# EAGLE schematic VerdiRT7_MainPCB (EAGLE 8.5.2)

## Sheet 1 of 6
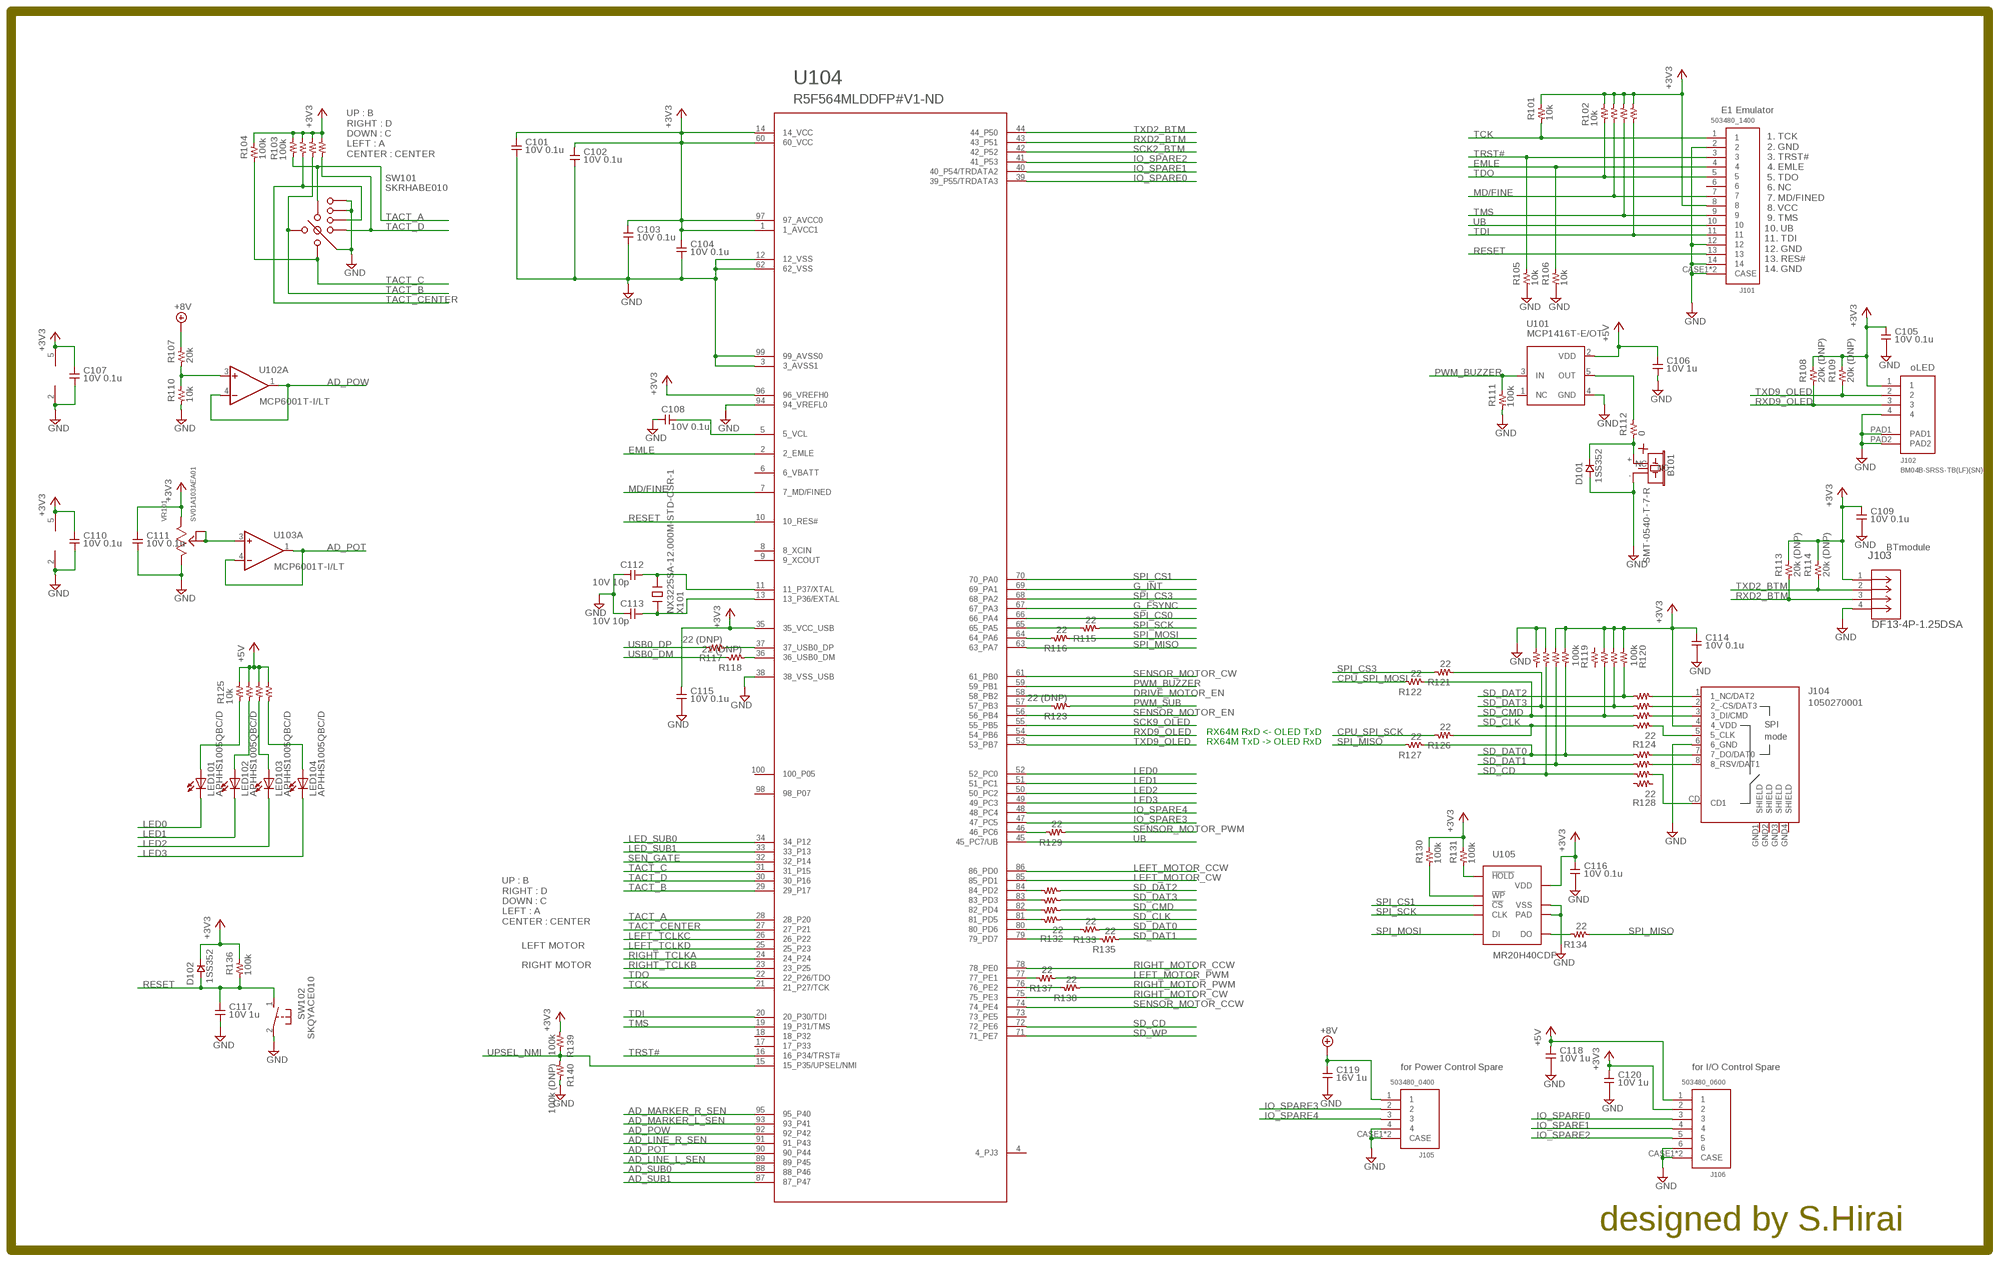
[diagram p0: schematic, sheet 1]

### Parts
B101  SMT-0540-T-7-R  [SMT-0540-S-R]
C101  10V 0.1u  1005  [1005]
C102  10V 0.1u  1005  [1005]
C103  10V 0.1u  1005  [1005]
C104  10V 0.1u  1005  [1005]
C105  10V 0.1u  1005  [1005]
C106  10V 1u  1005  [1005]
C107  10V 0.1u  1005  [1005]
C108  10V 0.1u  1005  [1005]
C109  10V 0.1u  1005  [1005]
C110  10V 0.1u  1005  [1005]
C111  10V 0.1u  1005  [1005]
C112  10V 10p  1005  [1005]
C113  10V 10p  1005  [1005]
C114  10V 0.1u  1005  [1005]
C115  10V 0.1u  1005  [1005]
C116  10V 0.1u  1005  [1005]
C117  10V 1u  1005  [1005]
C118  10V 1u  1005  [1005]
C119  16V 1u  1005  [1005]
C120  10V 1u  1005  [1005]
D101  1SS352  [2012]
D102  1SS352  [2012]
J101  503480_1400  [1400]
J102  BM04B-SRSS-TB(LF)(SN)  [BM04B-SRSS-TB]
J103  DF13-4P-1.25DSA  [DF13_4P_TH]
J104  1050270001  [MOLEX_105027]
J105  503480_0400  [0400]
J106  503480_0600  [0600]
LED101  APHHS1005QBC/D  LED1005  [1005]
LED102  APHHS1005QBC/D  LED1005  [1005]
LED103  APHHS1005QBC/D  LED1005  [1005]
LED104  APHHS1005QBC/D  LED1005  [1005]
R101  10k  R1005  [1005]
R102  10k  3216_ARRAY  [3216_ARRAY]
R103  100k  3216_ARRAY  [3216_ARRAY]
R104  100k  R1005  [1005]
R105  10k  R1005  [1005]
R106  10k  R1005  [1005]
R107  20k  R1005  [1005]
R108  20k (DNP)  R1005  [1005]
R109  20k (DNP)  R1005  [1005]
R110  10k  R1005  [1005]
R111  100k  R1005  [1005]
R112  0  R1005  [1005]
R113  20k (DNP)  R1005  [1005]
R114  20k (DNP)  R1005  [1005]
R115  22  R1005  [1005]
R116  22  R1005  [1005]
R117  22 (DNP)  R1005  [1005]
R118  22 (DNP)  R1005  [1005]
R119  100k  3216_ARRAY  [3216_ARRAY]
R120  100k  3216_ARRAY  [3216_ARRAY]
R121  22  R1005  [1005]
R122  22  R1005  [1005]
R123  22 (DNP)  R1005  [1005]
R124  22  3216_ARRAY  [3216_ARRAY]
R125  10k  3216_ARRAY  [3216_ARRAY]
R126  22  R1005  [1005]
R127  22  R1005  [1005]
R128  22  3216_ARRAY  [3216_ARRAY]
R129  22  R1005  [1005]
R130  100k  R1005  [1005]
R131  100k  R1005  [1005]
R132  22  3216_ARRAY  [3216_ARRAY]
R133  22  R1005  [1005]
R134  22  R1005  [1005]
R135  22  R1005  [1005]
R136  100k  R1005  [1005]
R137  22  R1005  [1005]
R138  22  R1005  [1005]
R139  100k  R1005  [1005]
R140  100k (DNP)  R1005  [1005]
SW101  SKRHABE010  [SKRH]
SW102  SKQYACE010  [SKQYA]
U101  MCP1416T-E/OT  [SOT23-5]
U102  MCP6001T-I/LT  [SOT-70-5]
U103  MCP6001T-I/LT  [SOT-70-5]
U104  R5F564MLDDFP#V1-ND  [TQFP100-16X16]
U105  MR20H40CDF  [8DFN]
VR101  SV01A103AEA01  [SV01]
X101  NX3225SA-12.000M-STD-CSR-1  [3225]

### Nets
+3V3: C101.P$1 C102.P$1 C103.P$1 C104.P$1 C105.P$1 C107.P$1 C109.P$1 C110.P$1 C111.P$1 C114.P$1 C115.P$1 C116.P$1 C120.P$1 D102.K J101.8 J102.1 J103.1 J104.4(4_VDD) J106.2 R101.P$2 R102.R1-B R102.R2-B R102.R3-B R102.R4-B R103.R1-B R103.R2-B R103.R3-B R103.R4-B R104.P$2 R108.P$2 R109.P$2 R113.P$2 R114.P$2 R119.R1-A R119.R2-A R120.R1-A R120.R2-A R120.R3-A R130.P$2 R131.P$2 R136.P$2 R139.P$1 U102.5(V+) U103.5(V+) U104.1(1_AVCC1) U104.14(14_VCC) U104.35(35_VCC_USB) U104.60(60_VCC) U104.96(96_VREFH0) U104.97(97_AVCC0) U105.8(VDD) VR101.2 ; also sheet 2,3,4,5
+5V: C106.P$1 C118.P$1 J106.1 R125.R1-B R125.R2-B R125.R3-B R125.R4-B U101.2(VDD) ; also sheet 2,3,4
+8V: C119.P$1 J105.1 R107.P$2 ; also sheet 2,3
AD_LINE_L_SEN: U104.89(89_P45) ; also sheet 4
AD_LINE_R_SEN: U104.91(91_P43) ; also sheet 4
AD_MARKER_L_SEN: U104.93(93_P41) ; also sheet 4
AD_MARKER_R_SEN: U104.95(95_P40) ; also sheet 4
AD_POT: U103.1(A:OUT) U103.4(A:-IN) U104.90(90_P44)
AD_POW: U102.1(A:OUT) U102.4(A:-IN) U104.92(92_P42)
AD_SUB0: U104.88(88_P46)
AD_SUB1: U104.87(87_P47)
CPU_SD_DAT0: R133.P$2 U104.80(80_PD6)
CPU_SPI_MOSI: R116.P$2 R122.P$2 U104.64(64_PA6)
CPU_SPI_SCK: R115.P$2 R126.P$2 U104.65(65_PA5)
DRIVE_MOTOR_EN: U104.58(58_PB2) ; also sheet 3
EMLE: J101.4 R106.P$2 U104.2(2_EMLE)
G_FSYNC: U104.67(67_PA3) ; also sheet 5
G_INT: U104.69(69_PA1) ; also sheet 5
GND: B101.- C101.P$2 C102.P$2 C103.P$2 C104.P$2 C105.P$2 C106.P$2 C107.P$2 C108.P$2 C109.P$2 C110.P$2 C111.P$2 C112.P$2 C113.P$2 C114.P$2 C115.P$2 C116.P$2 C117.P$2 C118.P$2 C119.P$2 C120.P$2 D101.A J101.2 J101.12 J101.14 J101.CASE1(CASE) J101.CASE2(CASE) J102.4 J102.PAD1 J102.PAD2 J103.4 J104.6(6_GND) J105.4 J105.CASE1(CASE) J105.CASE2(CASE) J106.6 J106.CASE1(CASE) J106.CASE2(CASE) R105.P$1 R106.P$1 R110.P$1 R111.P$1 R119.R3-A R119.R4-A R140.P$2 SW101.1 SW101.2 SW101.COMMON SW102.2 U101.4(GND) U102.2(V-) U103.2(V-) U104.3(3_AVSS1) U104.12(12_VSS) U104.38(38_VSS_USB) U104.62(62_VSS) U104.94(94_VREFL0) U104.99(99_AVSS0) U105.4(VSS) U105.PAD VR101.1 ; also sheet 2,3,4,5
IO_SPARE0: J106.3 U104.39(39_P55/TRDATA3)
IO_SPARE1: J106.4 U104.40(40_P54/TRDATA2)
IO_SPARE2: J106.5 U104.41(41_P53)
IO_SPARE3: J105.2 U104.47(47_PC5)
IO_SPARE4: J105.3 U104.48(48_PC4)
LED0: LED101.K U104.52(52_PC0)
LED1: LED102.K U104.51(51_PC1)
LED2: LED103.K U104.50(50_PC2)
LED3: LED104.K U104.49(49_PC3)
LED_SUB0: U104.34(34_P12)
LED_SUB1: U104.33(33_P13)
LEFT_MOTOR_CCW: U104.86(86_PD0) ; also sheet 3
LEFT_MOTOR_CW: U104.85(85_PD1) ; also sheet 3
LEFT_MOTOR_PWM: R137.P$1 ; also sheet 3
LEFT_TCLKC: U104.26(26_P22) ; also sheet 3
LEFT_TCLKD: U104.25(25_P23) ; also sheet 3
MD/FINE: J101.7 R102.R2-A U104.7(7_MD/FINED)
N$6: C108.P$1 U104.5(5_VCL)
N$13: C112.P$1 U104.11(11_P37/XTAL) X101.3
N$16: R131.P$1 U105.7(!HOLD)
N$17: R112.P$2 U101.5(OUT)
N$18: B101.+ D101.K R112.P$1
N$20: U103.3(A:+IN) VR101.3 VR101.4
N$21: R130.P$1 U105.3(!WP)
N$23: C113.P$1 U104.13(13_P36/EXTAL) X101.1
N$24: J104.5(5_CLK) R124.R1-A
N$25: J104.3(3_DI/CMD) R124.R2-A
N$26: J104.2(2_-CS/DAT3) R124.R3-A
N$27: R107.P$1 R110.P$2 U102.3(A:+IN)
N$28: J104.1(1_NC/DAT2) R124.R4-A
N$32: J104.8(8_RSV/DAT1) R128.R3-A
N$45: R134.P$2 U105.2(DO)
N$53: J104.7(7_DO/DAT0) R128.R4-A
N$56: LED101.A R125.R1-A
N$57: LED102.A R125.R2-A
N$58: LED103.A R125.R3-A
N$59: LED104.A R125.R4-A
N$83: J104.CD(CD1) R128.R2-A
N$89: R132.R4-B U104.84(84_PD2)
N$90: R132.R3-B U104.83(83_PD3)
N$91: R132.R2-B U104.82(82_PD4)
N$92: R132.R1-B U104.81(81_PD5)
N$93: R135.P$2 U104.79(79_PD7)
N$94: R123.P$2 U104.57(57_PB3)
N$95: R117.P$1 U104.37(37_USB0_DP)
N$96: R118.P$1 U104.36(36_USB0_DM)
PWM_BUZZER: R111.P$2 U101.3(IN) U104.59(59_PB1)
PWM_MOT1_MPU: R137.P$2 U104.77(77_PE1)
PWM_MOT2_MPU: R138.P$2 U104.76(76_PE2)
PWM_MOT3_MPU: R129.P$2 U104.46(46_PC6)
PWM_SUB: R123.P$1
RESET: C117.P$1 D102.A J101.13 R136.P$1 SW102.1 U104.10(10_RES#)
RIGHT_MOTOR_CCW: U104.78(78_PE0) ; also sheet 3
RIGHT_MOTOR_CW: U104.75(75_PE3) ; also sheet 3
RIGHT_MOTOR_PWM: R138.P$1 ; also sheet 3
RIGHT_TCLKA: U104.24(24_P24) ; also sheet 3
RIGHT_TCLKB: U104.23(23_P25) ; also sheet 3
RXD2_BTM: J103.3 R113.P$1 U104.43(43_P51)
RXD9_OLED: J102.3 R108.P$1 U104.54(54_PB6)
SCK2_BTM: U104.42(42_P52)
SCK9_OLED: U104.55(55_PB5)
SD_CD: R119.R3-B R128.R2-B U104.72(72_PE6)
SD_CLK: R124.R1-B R126.P$1 R132.R1-A
SD_CMD: R120.R3-B R122.P$1 R124.R2-B R132.R2-A
SD_DAT0: R119.R1-B R127.P$1 R128.R4-B R133.P$1
SD_DAT1: R119.R2-B R128.R3-B R135.P$1
SD_DAT2: R120.R1-B R124.R4-B R132.R4-A
SD_DAT3: R120.R2-B R121.P$1 R124.R3-B R132.R3-A
SD_WP: U104.71(71_PE7)
SEN_GATE: U104.32(32_P14) ; also sheet 4
SENSOR_MOTOR_CCW: U104.74(74_PE4) ; also sheet 3
SENSOR_MOTOR_CW: U104.61(61_PB0) ; also sheet 3
SENSOR_MOTOR_EN: U104.56(56_PB4) ; also sheet 3
SENSOR_MOTOR_PWM: R129.P$1 ; also sheet 3
SPI_CS0: U104.66(66_PA4) ; also sheet 5
SPI_CS1: U104.70(70_PA0) U105.1(!CS)
SPI_CS3: R121.P$2 U104.68(68_PA2)
SPI_MISO: R127.P$2 R134.P$1 U104.63(63_PA7) ; also sheet 5
SPI_MOSI: R116.P$1 U105.5(DI) ; also sheet 5
SPI_SCK: R115.P$1 U105.6(CLK) ; also sheet 5
TACT_A: R103.R1-A SW101.A U104.28(28_P20)
TACT_B: R103.R3-A SW101.B U104.29(29_P17)
TACT_C: R104.P$1 SW101.C U104.31(31_P15)
TACT_CENTER: R103.R2-A SW101.CENTER U104.27(27_P21)
TACT_D: R103.R4-A SW101.D U104.30(30_P16)
TCK: J101.1 R101.P$1 U104.21(21_P27/TCK)
TDI: J101.11 R102.R4-A U104.20(20_P30/TDI)
TDO: J101.5 R102.R1-A U104.22(22_P26/TDO)
TMS: J101.9 R102.R3-A U104.19(19_P31/TMS)
TRST#: J101.3 R105.P$2 U104.16(16_P34/TRST#)
TXD2_BTM: J103.2 R114.P$1 U104.44(44_P50)
TXD9_OLED: J102.2 R109.P$1 U104.53(53_PB7)
UB: J101.10 U104.45(45_PC7/UB)
UPSEL_NMI: R139.P$2 R140.P$1 U104.15(15_P35/UPSEL/NMI)
USB0_DM: R118.P$2
USB0_DP: R117.P$2
Unconnected: B101.NC J101.6 J104.GND1(SHIELD) J104.GND2(SHIELD) J104.GND3(SHIELD) J104.GND4(SHIELD) R119.R4-B R120.R4-A R120.R4-B R128.R1-A R128.R1-B U101.1(NC) U104.4(4_PJ3) U104.6(6_VBATT) U104.8(8_XCIN) U104.9(9_XCOUT) U104.17(17_P33) U104.18(18_P32) U104.73(73_PE5) U104.98(98_P07) U104.100(100_P05) X101.2 X101.4

### Notes on the sheet
- E1 Emulator
- 1. TCK
   2. GND
   3. TRST#
   4. EMLE
   5. TDO
   6. NC
   7. MD/FINED
   8. VCC
   9. TMS
  10. UB
  11. TDI
  12. GND
  13. RES#
  14. GND
- UP : B
  RIGHT : D
  DOWN : C
  LEFT : A
  CENTER : CENTER
- oLED
- BTmodule
- RX64M RxD <- OLED TxD
- RX64M TxD -> OLED RxD
- UP : B
  RIGHT : D
  DOWN : C
  LEFT : A
  CENTER : CENTER
- LEFT MOTOR
- RIGHT MOTOR
- for Power Control Spare | for I/O Control Spare
- designed by S.Hirai

## Sheet 2 of 6
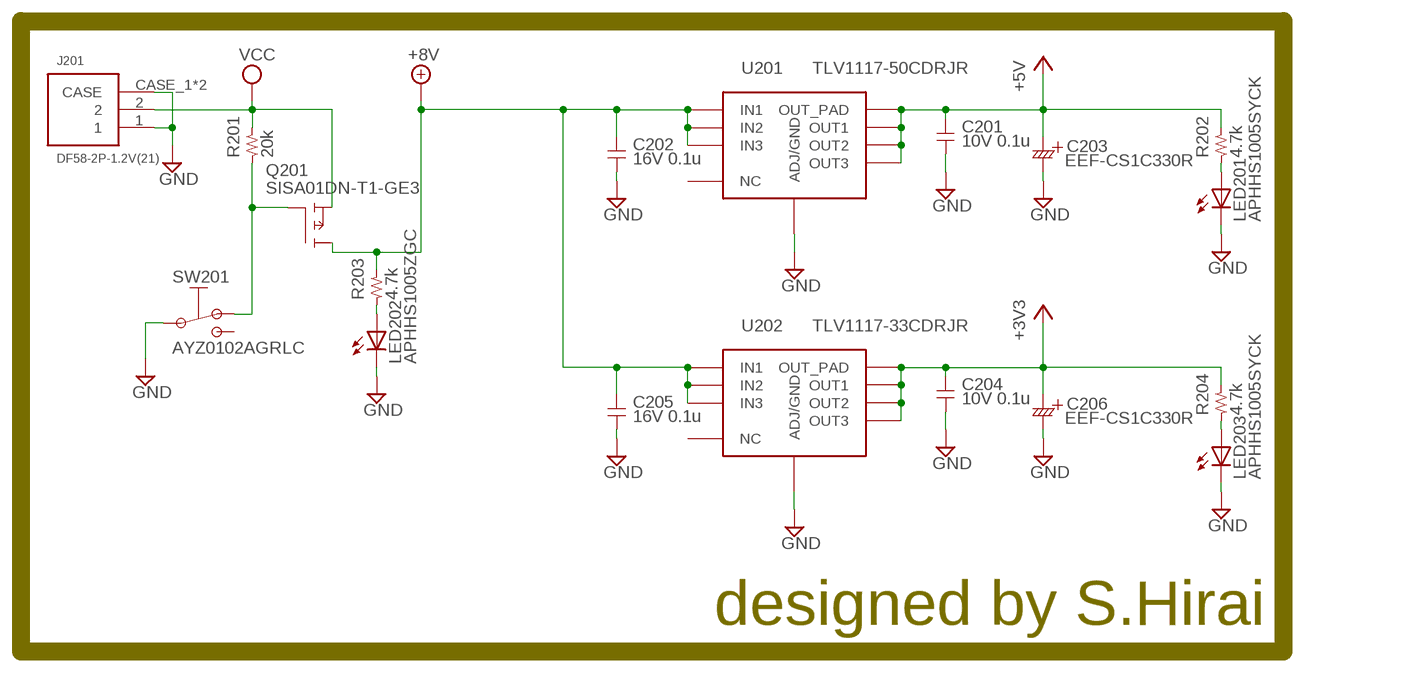
[diagram p1: schematic, sheet 2]

### Parts
C201  10V 0.1u  1005  [1005]
C202  16V 0.1u  1005  [1005]
C203  EEF-CS1C330R  [EEFC_7343]
C204  10V 0.1u  1005  [1005]
C205  16V 0.1u  1005  [1005]
C206  EEF-CS1C330R  [EEFC_7343]
J201  DF58-2P-1.2V(21)  [DF58_2P]
LED201  APHHS1005SYCK  LED1005  [1005]
LED202  APHHS1005ZGC  LED1005  [1005]
LED203  APHHS1005SYCK  LED1005  [1005]
Q201  SISA01DN-T1-GE3  [POWERPAK1212-8]
R201  20k  R1005  [1005]
R202  4.7k  R1005  [1005]
R203  4.7k  R1005  [1005]
R204  4.7k  R1005  [1005]
SW201  AYZ0102AGRLC  [AYZ0102AGRLC]
U201  TLV1117-50CDRJR  [WFDFN8]
U202  TLV1117-33CDRJR  [WFDFN8]

### Nets
+3V3: C204.P$1 C206.PLUS R204.P$2 U202.5(OUT1) U202.6(OUT2) U202.7(OUT3) U202.PAD(OUT_PAD) ; also sheet 1,3,4,5
+5V: C201.P$1 C203.PLUS R202.P$2 U201.5(OUT1) U201.6(OUT2) U201.7(OUT3) U201.PAD(OUT_PAD) ; also sheet 1,3,4
+8V: C202.P$1 C205.P$1 Q201.5(D) Q201.9(D) R203.P$2 U201.2(IN1) U201.3(IN2) U201.4(IN3) U202.2(IN1) U202.3(IN2) U202.4(IN3) ; also sheet 1,3
GND: C201.P$2 C202.P$2 C203.MINUS C204.P$2 C205.P$2 C206.MINUS J201.1 J201.CASE_1(CASE) J201.CASE_2(CASE) LED201.K LED202.K LED203.K SW201.2 U201.1(ADJ/GND) U202.1(ADJ/GND) ; also sheet 1,3,4,5
N$1: Q201.4(G) R201.P$1 SW201.1
N$3: LED202.A R203.P$1
N$12: LED201.A R202.P$1
N$78: LED203.A R204.P$1
VCC: J201.2 Q201.1(S) R201.P$2
Unconnected: SW201.3 U201.8(NC) U202.8(NC)

### Notes on the sheet
- designed by S.Hirai

## Sheet 3 of 6
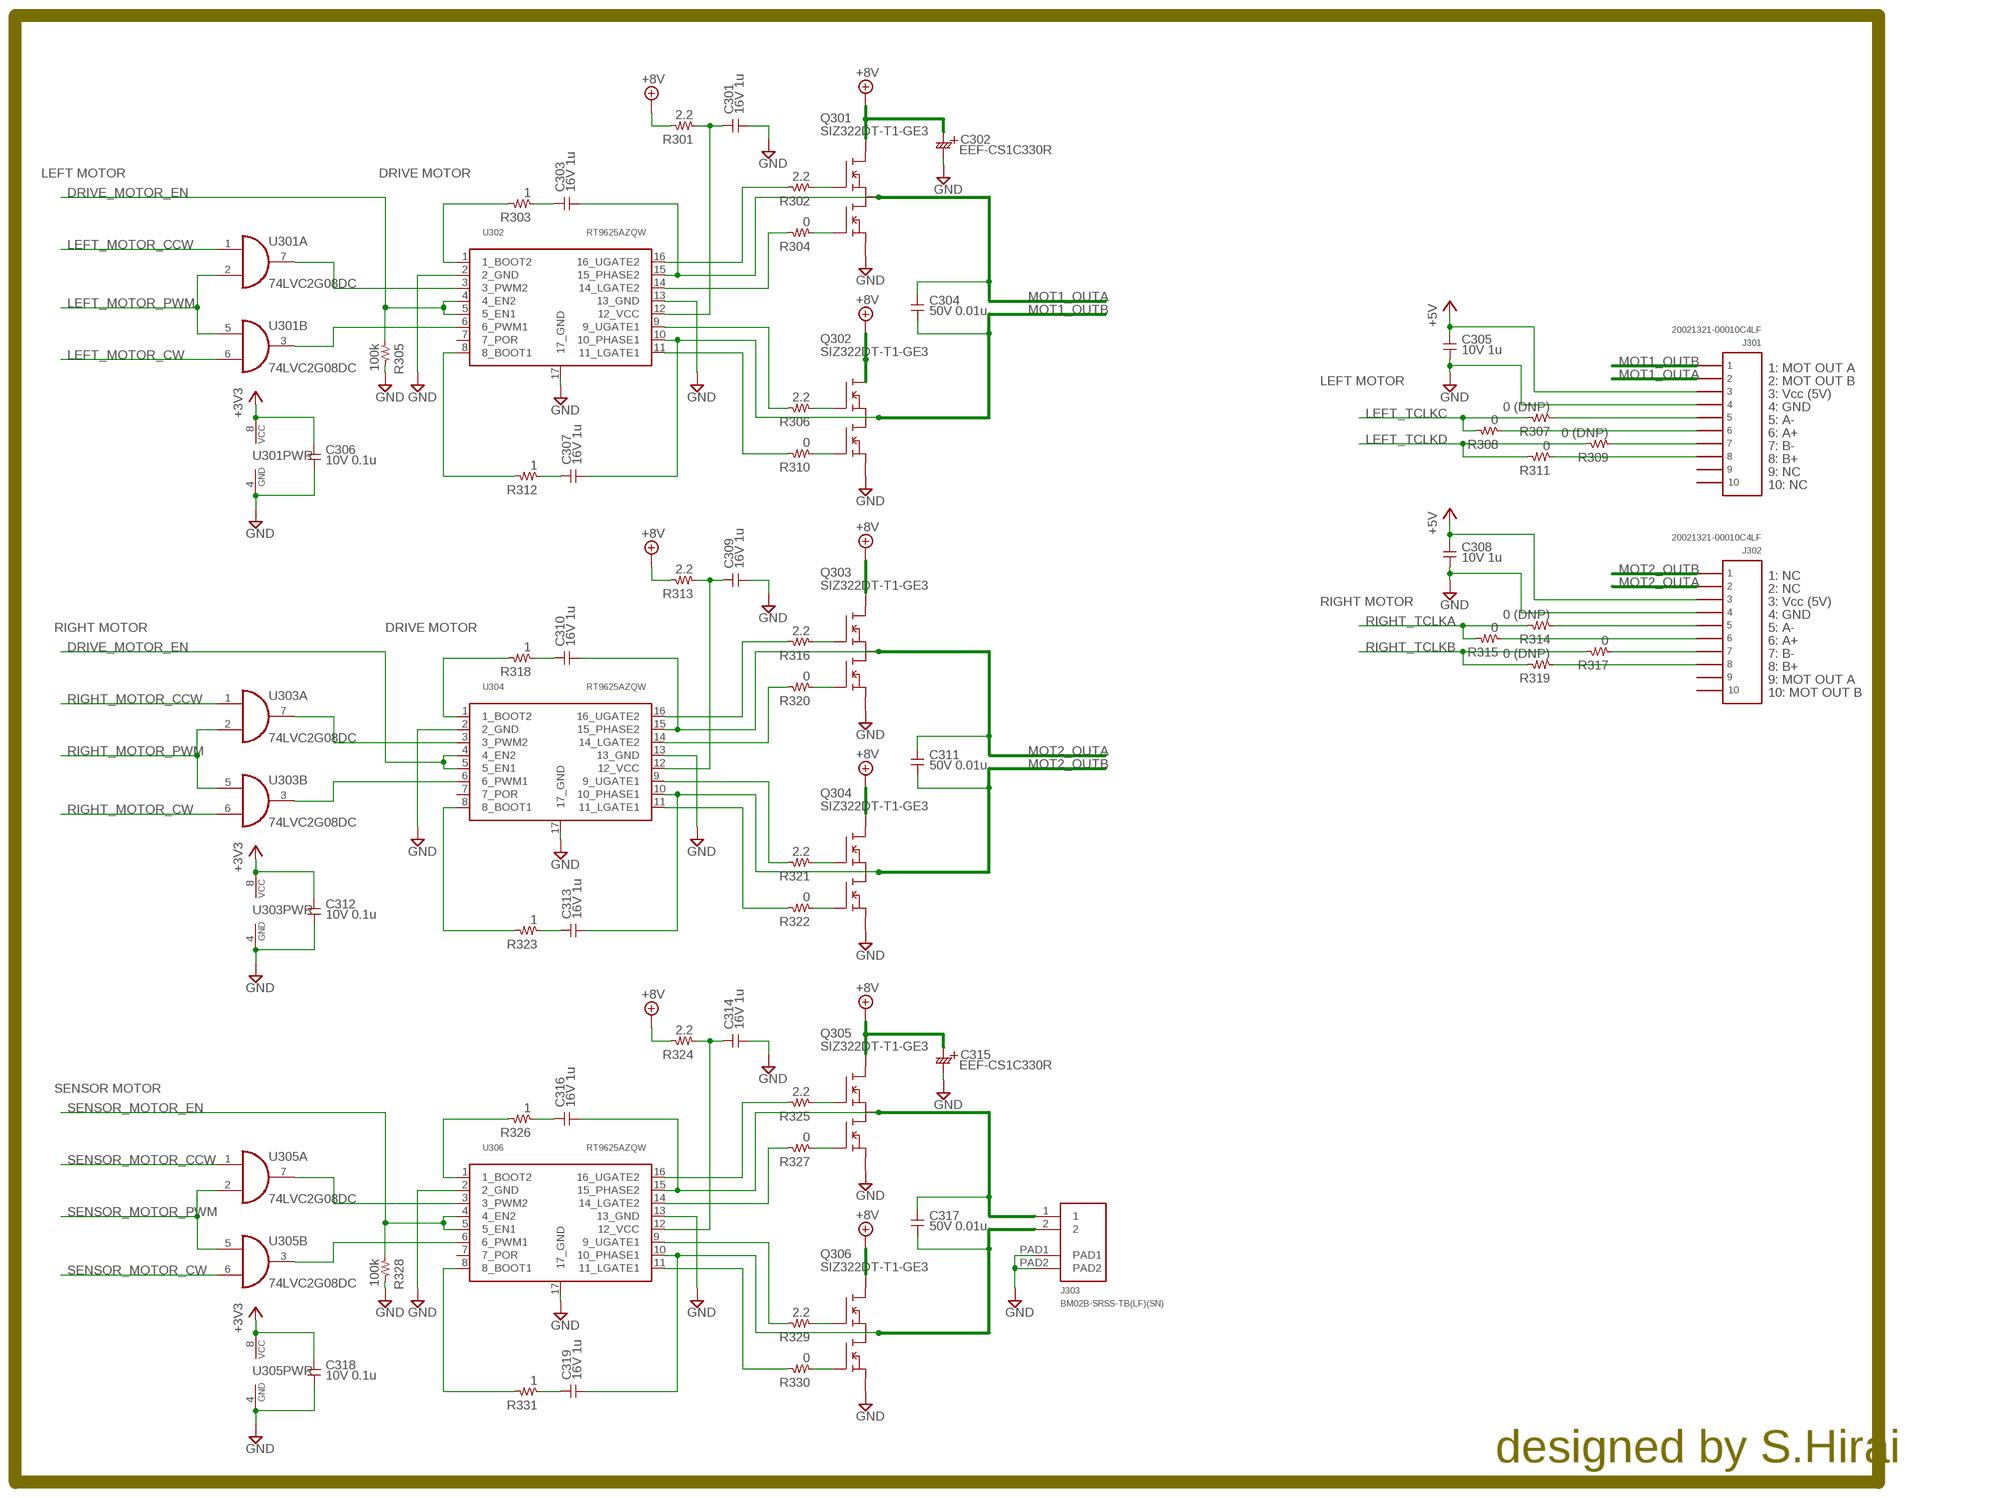
[diagram p2: schematic, sheet 3]

### Parts
C301  16V 1u  1005  [1005]
C302  EEF-CS1C330R  [EEFC_7343]
C303  16V 1u  1005  [1005]
C304  50V 0.01u  1005  [1005]
C305  10V 1u  1005  [1005]
C306  10V 0.1u  1005  [1005]
C307  16V 1u  1005  [1005]
C308  10V 1u  1005  [1005]
C309  16V 1u  1005  [1005]
C310  16V 1u  1005  [1005]
C311  50V 0.01u  1005  [1005]
C312  10V 0.1u  1005  [1005]
C313  16V 1u  1005  [1005]
C314  16V 1u  1005  [1005]
C315  EEF-CS1C330R  [EEFC_7343]
C316  16V 1u  1005  [1005]
C317  50V 0.01u  1005  [1005]
C318  10V 0.1u  1005  [1005]
C319  16V 1u  1005  [1005]
J301  20021321-00010C4LF  [MA5-2_SMD_1.27MM_MIN]
J302  20021321-00010C4LF  [MA5-2_SMD_1.27MM_MIN]
J303  BM02B-SRSS-TB(LF)(SN)  [BM02B-SRSS-TB]
Q301  SIZ322DT-T1-GE3  [DFN3X3A]
Q302  SIZ322DT-T1-GE3  [DFN3X3A]
Q303  SIZ322DT-T1-GE3  [DFN3X3A]
Q304  SIZ322DT-T1-GE3  [DFN3X3A]
Q305  SIZ322DT-T1-GE3  [DFN3X3A]
Q306  SIZ322DT-T1-GE3  [DFN3X3A]
R301  2.2  R1005  [1005]
R302  2.2  R1005  [1005]
R303  1  R1005  [1005]
R304  0  R1005  [1005]
R305  100k  R1005  [1005]
R306  2.2  R1005  [1005]
R307  0 (DNP)  R1005  [1005]
R308  0  R1005  [1005]
R309  0 (DNP)  R1005  [1005]
R310  0  R1005  [1005]
R311  0  R1005  [1005]
R312  1  R1005  [1005]
R313  2.2  R1005  [1005]
R314  0 (DNP)  R1005  [1005]
R315  0  R1005  [1005]
R316  2.2  R1005  [1005]
R317  0  R1005  [1005]
R318  1  R1005  [1005]
R319  0 (DNP)  R1005  [1005]
R320  0  R1005  [1005]
R321  2.2  R1005  [1005]
R322  0  R1005  [1005]
R323  1  R1005  [1005]
R324  2.2  R1005  [1005]
R325  2.2  R1005  [1005]
R326  1  R1005  [1005]
R327  0  R1005  [1005]
R328  100k  R1005  [1005]
R329  2.2  R1005  [1005]
R330  0  R1005  [1005]
R331  1  R1005  [1005]
U301  74LVC2G08DC  [VSSOP8]
U302  RT9625AZQW  [WQFN16]
U303  74LVC2G08DC  [VSSOP8]
U304  RT9625AZQW  [WQFN16]
U305  74LVC2G08DC  [VSSOP8]
U306  RT9625AZQW  [WQFN16]

### Nets
1_A+: J302.6 R315.P$1
1_A-: J302.5 R314.P$1
2_B+: J302.8 R319.P$1
2_B-: J302.7 R317.P$1
3_A+: J301.6 R308.P$1
3_A-: J301.5 R307.P$1
4_B+: J301.8 R311.P$1
4_B-: J301.7 R309.P$1
+3V3: C306.P$1 C312.P$1 C318.P$1 U301.8(PWR:VCC) U303.8(PWR:VCC) U305.8(PWR:VCC) ; also sheet 1,2,4,5
+5V: C305.P$1 C308.P$1 J301.3 J302.3 ; also sheet 1,2,4
+8V: C302.PLUS C315.PLUS Q301.2(D1) Q301.3(D1) Q301.4(D1) Q301.PAD_S(D1) Q302.2(D1) Q302.3(D1) Q302.4(D1) Q302.PAD_S(D1) Q303.2(D1) Q303.3(D1) Q303.4(D1) Q303.PAD_S(D1) Q304.2(D1) Q304.3(D1) Q304.4(D1) Q304.PAD_S(D1) Q305.2(D1) Q305.3(D1) Q305.4(D1) Q305.PAD_S(D1) Q306.2(D1) Q306.3(D1) Q306.4(D1) Q306.PAD_S(D1) R301.P$2 R313.P$2 R324.P$2 ; also sheet 1,2
DRIVE_MOTOR_EN: R305.P$1 U302.4(4_EN2) U302.5(5_EN1) U304.4(4_EN2) U304.5(5_EN1) ; also sheet 1
GND: C301.P$2 C302.MINUS C305.P$2 C306.P$2 C308.P$2 C309.P$2 C312.P$2 C314.P$2 C315.MINUS C318.P$2 J301.4 J302.4 J303.PAD1 J303.PAD2 Q301.5(S2) Q301.6(S2) Q301.7(S2) Q302.5(S2) Q302.6(S2) Q302.7(S2) Q303.5(S2) Q303.6(S2) Q303.7(S2) Q304.5(S2) Q304.6(S2) Q304.7(S2) Q305.5(S2) Q305.6(S2) Q305.7(S2) Q306.5(S2) Q306.6(S2) Q306.7(S2) R305.P$2 R328.P$2 U301.4(PWR:GND) U302.2(2_GND) U302.13(13_GND) U302.17(17_GND) U303.4(PWR:GND) U304.2(2_GND) U304.13(13_GND) U304.17(17_GND) U305.4(PWR:GND) U306.2(2_GND) U306.13(13_GND) U306.17(17_GND) ; also sheet 1,2,4,5
LEFT_MOTOR_CCW: U301.1(A:I0) ; also sheet 1
LEFT_MOTOR_CW: U301.6(B:I1) ; also sheet 1
LEFT_MOTOR_PWM: U301.2(A:I1) U301.5(B:I0) ; also sheet 1
LEFT_TCLKC: R307.P$2 R308.P$2 ; also sheet 1
LEFT_TCLKD: R309.P$2 R311.P$2 ; also sheet 1
MOT1_OUTA: C303.P$2 C304.P$1 J301.2 Q301.PAD_L(S1D2) U302.15(15_PHASE2)
MOT1_OUTB: C304.P$2 C307.P$2 J301.1 Q302.PAD_L(S1D2) U302.10(10_PHASE1)
MOT2_OUTA: C310.P$2 C311.P$1 J302.2 Q303.PAD_L(S1D2) U304.15(15_PHASE2)
MOT2_OUTB: C311.P$2 C313.P$2 J302.1 Q304.PAD_L(S1D2) U304.10(10_PHASE1)
N$8: C317.P$2 C319.P$2 J303.2 Q306.PAD_L(S1D2) U306.10(10_PHASE1)
N$9: Q306.1(G1) R329.P$1
N$10: Q306.8(G2) R330.P$1
N$14: R318.P$2 U304.1(1_BOOT2)
N$15: C310.P$1 R318.P$1
N$22: R323.P$2 U304.8(8_BOOT1)
N$29: C313.P$1 R323.P$1
N$30: C309.P$1 R313.P$1 U304.12(12_VCC)
N$31: U303.7(A:O) U304.3(3_PWM2)
N$33: U303.3(B:O) U304.6(6_PWM1)
N$34: R322.P$2 U304.11(11_LGATE1)
N$35: R321.P$2 U304.9(9_UGATE1)
N$36: R320.P$2 U304.14(14_LGATE2)
N$37: Q303.8(G2) R320.P$1
N$38: R316.P$2 U304.16(16_UGATE2)
N$39: Q303.1(G1) R316.P$1
N$41: Q304.1(G1) R321.P$1
N$42: Q304.8(G2) R322.P$1
N$43: R303.P$2 U302.1(1_BOOT2)
N$44: C303.P$1 R303.P$1
N$46: R312.P$2 U302.8(8_BOOT1)
N$47: C307.P$1 R312.P$1
N$48: C301.P$1 R301.P$1 U302.12(12_VCC)
N$49: U301.7(A:O) U302.3(3_PWM2)
N$50: U301.3(B:O) U302.6(6_PWM1)
N$51: R310.P$2 U302.11(11_LGATE1)
N$52: R306.P$2 U302.9(9_UGATE1)
N$55: R304.P$2 U302.14(14_LGATE2)
N$61: Q301.8(G2) R304.P$1
N$63: R326.P$2 U306.1(1_BOOT2)
N$64: C316.P$1 R326.P$1
N$65: C316.P$2 C317.P$1 J303.1 Q305.PAD_L(S1D2) U306.15(15_PHASE2)
N$66: R331.P$2 U306.8(8_BOOT1)
N$67: C319.P$1 R331.P$1
N$68: R302.P$2 U302.16(16_UGATE2)
N$69: C314.P$1 R324.P$1 U306.12(12_VCC)
N$70: U305.7(A:O) U306.3(3_PWM2)
N$71: U305.3(B:O) U306.6(6_PWM1)
N$72: R330.P$2 U306.11(11_LGATE1)
N$73: Q301.1(G1) R302.P$1
N$74: R327.P$2 U306.14(14_LGATE2)
N$75: R329.P$2 U306.9(9_UGATE1)
N$77: Q305.8(G2) R327.P$1
N$79: R325.P$2 U306.16(16_UGATE2)
N$80: Q305.1(G1) R325.P$1
N$81: Q302.1(G1) R306.P$1
N$82: Q302.8(G2) R310.P$1
RIGHT_MOTOR_CCW: U303.1(A:I0) ; also sheet 1
RIGHT_MOTOR_CW: U303.6(B:I1) ; also sheet 1
RIGHT_MOTOR_PWM: U303.2(A:I1) U303.5(B:I0) ; also sheet 1
RIGHT_TCLKA: R314.P$2 R315.P$2 ; also sheet 1
RIGHT_TCLKB: R317.P$2 R319.P$2 ; also sheet 1
SENSOR_MOTOR_CCW: U305.1(A:I0) ; also sheet 1
SENSOR_MOTOR_CW: U305.6(B:I1) ; also sheet 1
SENSOR_MOTOR_EN: R328.P$1 U306.4(4_EN2) U306.5(5_EN1) ; also sheet 1
SENSOR_MOTOR_PWM: U305.2(A:I1) U305.5(B:I0) ; also sheet 1
Unconnected: J301.9 J301.10 J302.9 J302.10 U302.7(7_POR) U304.7(7_POR) U306.7(7_POR)

### Notes on the sheet
- LEFT MOTOR | DRIVE MOTOR
- 1: MOT OUT A
- LEFT MOTOR | 2: MOT OUT B
- 3: Vcc (5V)
- 4: GND
- 5: A-
- 6: A+
- 7: B-
- 8: B+
- 9: NC
- 10: NC
- 1: NC
- 2: NC
- RIGHT MOTOR | 3: Vcc (5V)
- 4: GND
- RIGHT MOTOR | DRIVE MOTOR | 5: A-
- 6: A+
- 7: B-
- 8: B+
- 9: MOT OUT A
- 10: MOT OUT B
- SENSOR MOTOR
- designed by S.Hirai

## Sheet 4 of 6
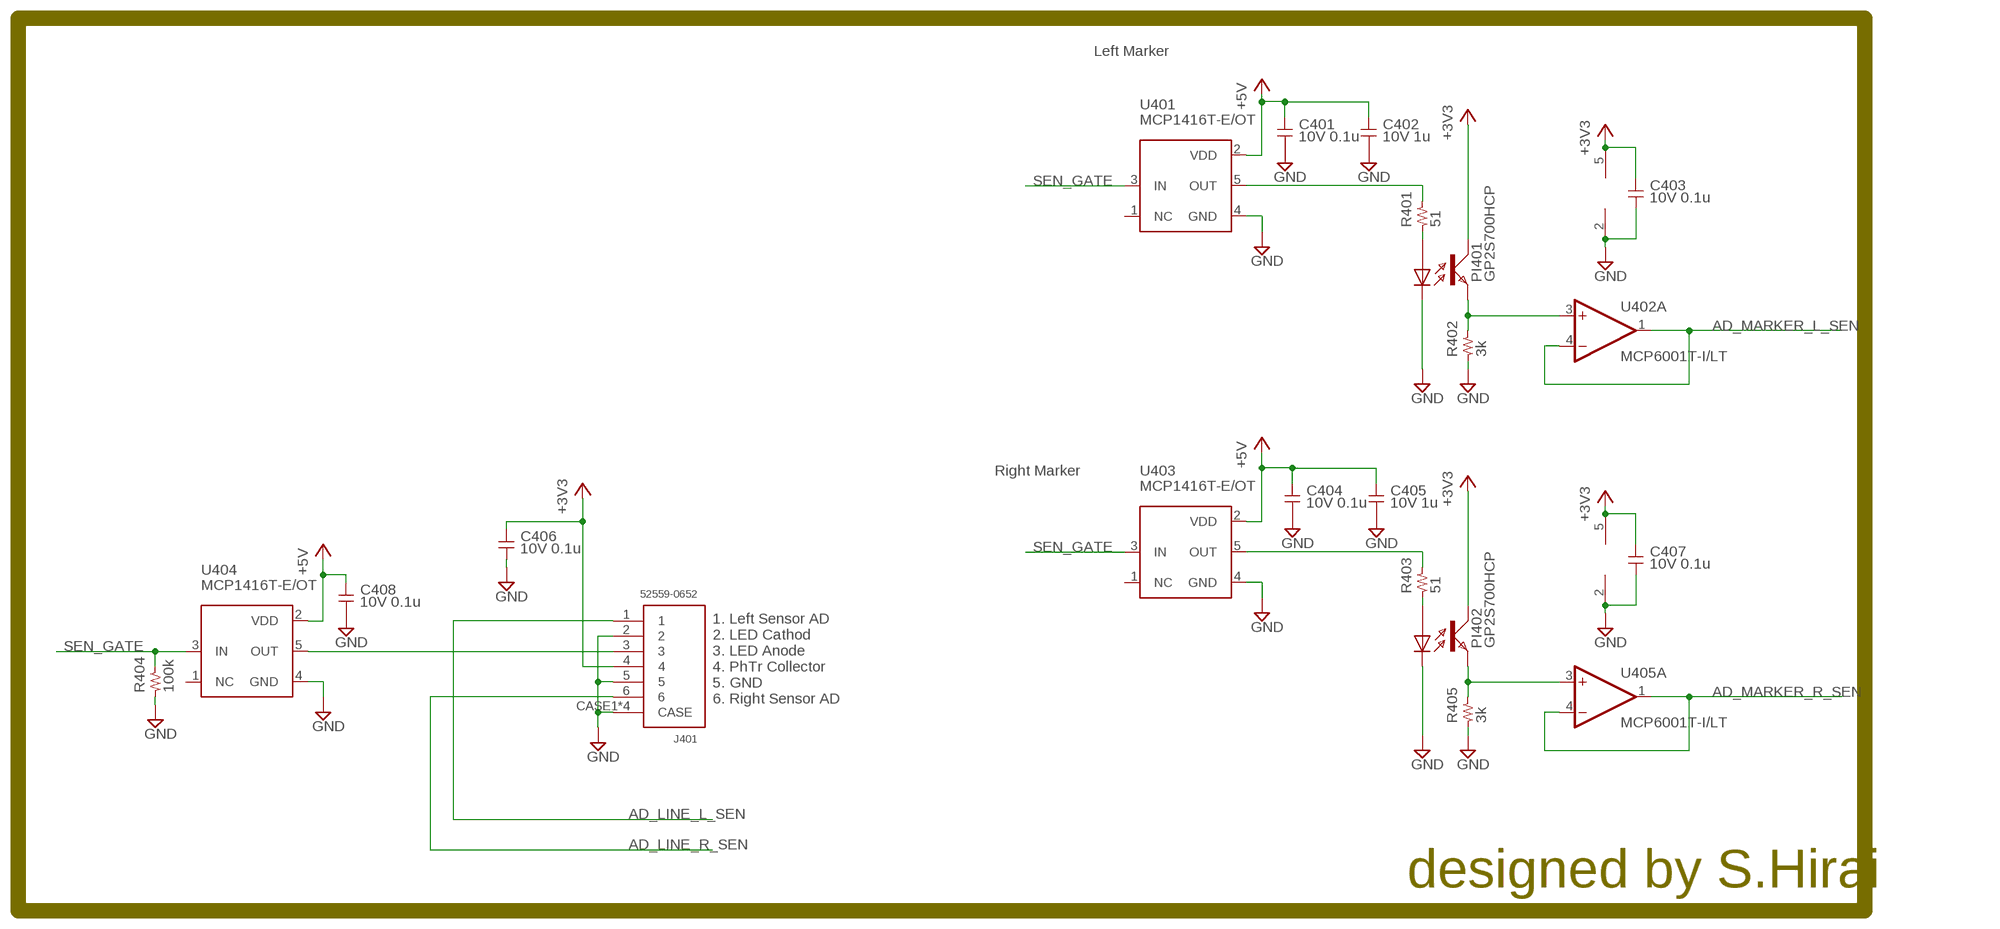
[diagram p3: schematic, sheet 4]

### Parts
C401  10V 0.1u  1005  [1005]
C402  10V 1u  1005  [1005]
C403  10V 0.1u  1005  [1005]
C404  10V 0.1u  1005  [1005]
C405  10V 1u  1005  [1005]
C406  10V 0.1u  1005  [1005]
C407  10V 0.1u  1005  [1005]
C408  10V 0.1u  1005  [1005]
J401  52559-0652  [0652]
PI401  GP2S700HCP  [GP2S700]
PI402  GP2S700HCP  [GP2S700]
R401  51  R1608  [1608]
R402  3k  R1005  [1005]
R403  51  R1608  [1608]
R404  100k  R1005  [1005]
R405  3k  R1005  [1005]
U401  MCP1416T-E/OT  [SOT23-5]
U402  MCP6001T-I/LT  [SOT-70-5]
U403  MCP1416T-E/OT  [SOT23-5]
U404  MCP1416T-E/OT  [SOT23-5]
U405  MCP6001T-I/LT  [SOT-70-5]

### Nets
+3V3: C403.P$1 C406.P$1 C407.P$1 J401.4 PI401.COLLECTOR PI402.COLLECTOR U402.5(V+) U405.5(V+) ; also sheet 1,2,3,5
+5V: C401.P$1 C402.P$1 C404.P$1 C405.P$1 C408.P$1 U401.2(VDD) U403.2(VDD) U404.2(VDD) ; also sheet 1,2,3
AD_LINE_L_SEN: J401.1 ; also sheet 1
AD_LINE_R_SEN: J401.6 ; also sheet 1
AD_MARKER_L_SEN: U402.1(A:OUT) U402.4(A:-IN) ; also sheet 1
AD_MARKER_R_SEN: U405.1(A:OUT) U405.4(A:-IN) ; also sheet 1
GND: C401.P$2 C402.P$2 C403.P$2 C404.P$2 C405.P$2 C406.P$2 C407.P$2 C408.P$2 J401.2 J401.5 J401.CASE1(CASE) J401.CASE2(CASE) J401.CASE3(CASE) J401.CASE4(CASE) PI401.CATHODE PI402.CATHODE R402.P$1 R404.P$1 R405.P$1 U401.4(GND) U402.2(V-) U403.4(GND) U404.4(GND) U405.2(V-) ; also sheet 1,2,3,5
N$2: J401.3 U404.5(OUT)
N$5: R401.P$2 U401.5(OUT)
N$11: PI401.ANODE R401.P$1
N$19: PI401.EMITTER R402.P$2 U402.3(A:+IN)
N$54: R403.P$2 U403.5(OUT)
N$60: PI402.ANODE R403.P$1
N$62: PI402.EMITTER R405.P$2 U405.3(A:+IN)
SEN_GATE: R404.P$2 U401.3(IN) U403.3(IN) U404.3(IN) ; also sheet 1
Unconnected: U401.1(NC) U403.1(NC) U404.1(NC)

### Notes on the sheet
- Left Marker
- Right Marker
- 1. Left Sensor AD
  2. LED Cathod
  3. LED Anode
  4. PhTr Collector
  5. GND
  6. Right Sensor AD
- designed by S.Hirai

## Sheet 5 of 6
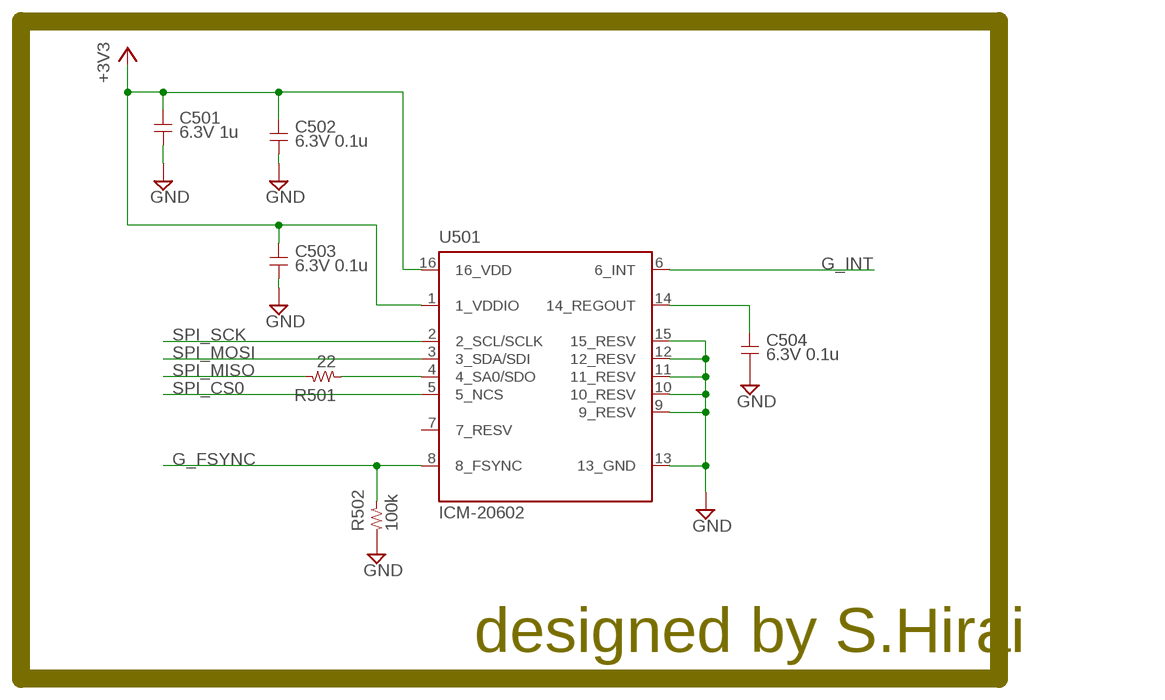
[diagram p4: schematic, sheet 5]

### Parts
C501  6.3V 1u  1005  [1005]
C502  6.3V 0.1u  1005  [1005]
C503  6.3V 0.1u  1005  [1005]
C504  6.3V 0.1u  1005  [1005]
R501  22  R1005  [1005]
R502  100k  R1005  [1005]
U501  ICM-20602  [LGA16_3X3MM]

### Nets
+3V3: C501.P$1 C502.P$1 C503.P$1 U501.1(1_VDDIO) U501.16(16_VDD) ; also sheet 1,2,3,4
G_FSYNC: R502.P$2 U501.8(8_FSYNC) ; also sheet 1
G_INT: U501.6(6_INT) ; also sheet 1
GND: C501.P$2 C502.P$2 C503.P$2 C504.P$2 R502.P$1 U501.9(9_RESV) U501.10(10_RESV) U501.11(11_RESV) U501.12(12_RESV) U501.13(13_GND) U501.15(15_RESV) ; also sheet 1,2,3,4
N$4: C504.P$1 U501.14(14_REGOUT)
N$85: R501.P$1 U501.4(4_SA0/SDO)
SPI_CS0: U501.5(5_NCS) ; also sheet 1
SPI_MISO: R501.P$2 ; also sheet 1
SPI_MOSI: U501.3(3_SDA/SDI) ; also sheet 1
SPI_SCK: U501.2(2_SCL/SCLK) ; also sheet 1

### Notes on the sheet
- designed by S.Hirai

## Sheet 6 of 6
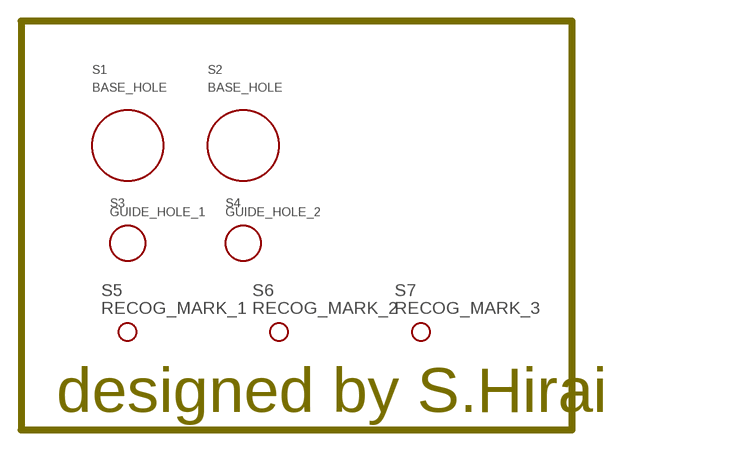
[diagram p5: schematic, sheet 6]

### Parts
S1  BASE_HOLE  [BASE_HOLE]
S2  BASE_HOLE  [BASE_HOLE]
S3  GUIDE_HOLE_1  [GUIDE_HOLE]
S4  GUIDE_HOLE_2  [GUIDE_HOLE]
S5  RECOG_MARK_1  [RECOG_MARK]
S6  RECOG_MARK_2  [RECOG_MARK]
S7  RECOG_MARK_3  [RECOG_MARK]

### Notes on the sheet
- designed by S.Hirai

## Power pins joined to a net without a drawn wire
7_RESV: U501.7(7_RESV)

## Library data of the parts
B101 = Buzzer:SMT-0540-*; HEIGHT: 2.1; REMARK: top hole
C101-C120 C201 C202 C204 C205 C301 C303-C314 C316-C319 C401-C408 C501-C504 = capacitor:1005; HEIGHT: 0.5
C203 C206 C302 C315 = capacitor:EEF-C?*R; CAPACITANCE: 33uF; HEIGHT: 1.2; VOLTAGE: 16V
D101 D102 = diode:1SS352: switching diode VF=0.98V trr=1.6ns CT=0.5pF 80V 100mA; HEIGHT: 0.9
J101 = molex_503480:503480_1400
J102 = jst_sh:?M04B-SRSS-TB(LF)(SN); HEIGHT: 6.3; MOUNT: top
J103 = Hirose_DF:DF13-4P-1.25DS*
J104 = sd-card:1050270001; HEIGHT: 1.7
J105 = molex_503480:503480_0400; HEIGHT: 1.0
J106 = molex_503480:503480_0600
J201 = Hirose_DF:DF58-2P-1.2V(21)
J301 J302 = pin_header:20021321-00010C4LF; HEIGHT: 4.5
J303 = jst_sh:?M02B-SRSS-TB(LF)(SN); HEIGHT: 6.3
J401 = molex_52559:52559-0652
LED101-LED104 LED201-LED203 = LED:LED; HEIGHT: 0.5
PI401 PI402 = Photo_Interrupter:GP2S700HCP; HEIGHT: 2
Q201 = MOSFET:SISA01DN
Q301-Q306 = MOSFET:SIZ322DT
R101 R104-R118 R121-R123 R126 R127 R129-R131 R133-R140 R201-R204 R301-R331 R402 R404 R405 R501 R502 = resistor:R; HEIGHT: 0.35
R102 R103 R119 R120 R124 R125 R128 R132 = resistor:3216_ARRAY; HEIGHT: 0.5
R401 R403 = resistor:R; HEIGHT: 0.45
S1 S2 = MountingSymbol:BASE_HOLE; HEIGHT: 0.1
S3 S4 = MountingSymbol:GUIDE_HOLE; HEIGHT: 0.1
S5-S7 = MountingSymbol:RECOG_MARK; HEIGHT: 0.1
SW101 = sw1:SKRH*; HEIGHT: 5
SW102 = switch:SKQYA*E010; FORCE: 0.98N; HEIGHT: 2.5
SW201 = switch:AYZ0102AGRLC; HEIGHT: 1.5
U101 U401 U403 U404 = Motor_Driver:MCP1416?T-E/OT; HEIGHT: 1.45
U102 U103 U402 U405 = OP-amp:MCP6001?-*; HEIGHT: 1.1; TEMP: -40 ~ 85 degC
U104 = renesas21:R5F564M*; HEIGHT: 2.1
U105 = Memory:MR2*H40; HEIGHT: 0.8
U201 U202 = regulator:TLV1117-*; HEIGHT: 0.75
U301 U303 U305 = 74xx-eu:74LVC2G08
U302 U304 U306 = Motor_Driver:RT9625AZQW; HEIGHT: 0.8
U501 = ICM-2060x:ICM-20602; HEIGHT: 0.8
VR101 = sensor2:SV01A*?; HEIGHT: 2.1
X101 = Oscillator:NX3225SA-*M-STD-CSR-1; HEIGHT: 0.7